# EAGLE schematic electronic-connection (EAGLE 7.7.0)
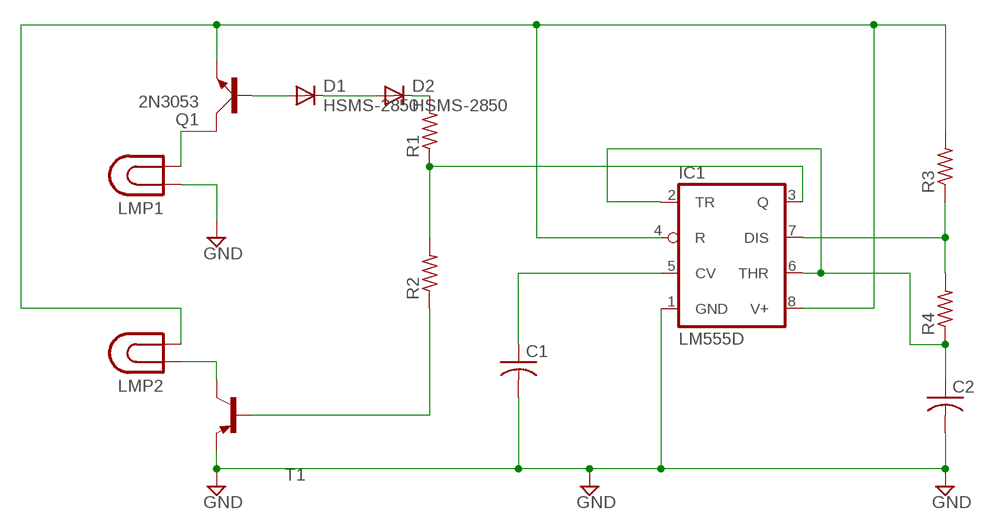
[diagram p0: schematic, sheet 1]

## Parts
C1  C-US025-024X044  [C025-024X044]
C2  C-US025-024X044  [C025-024X044]
D1  HSMS-2850  [SOT23]
D2  HSMS-2850  [SOT23]
IC1  LM555D  [SO08]
LMP1  LAMP  [LDH-5R]
LMP2  LAMP  [LDH-5R]
Q1  2N3053  [TO39]
R1  R-US_0204/2V  [0204V]
R2  R-US_0204/2V  [0204V]
R3  R-US_0204/2V  [0204V]
R4  R-US_0204/2V  [0204V]
T1  2N2905-PNP-TO39-EBC  [TO39]

## Nets
GND: C1.2 C2.2 IC1.1(GND) LMP1.1 T1.1(E)
N$1: IC1.4(R) IC1.8(V+) LMP2.2 Q1.1(E) R3.2
N$2: IC1.7(DIS) R3.1 R4.2
N$3: LMP1.2 Q1.3(C)
N$4: C1.1 IC1.5(CV)
N$5: C2.1 IC1.2(TR) IC1.6(THR) R4.1
N$6: IC1.3(Q) R1.1 R2.2
N$7: R2.1 T1.2(B)
N$8: LMP2.1 T1.3(C)
N$9: D1.1(A) Q1.2(B)
N$10: D1.3(C) D2.1(A)
N$11: D2.3(C) R1.2

## Library data of the parts
C1 C2 = rcl:C-US: CAPACITOR, American symbol
D1 D2 = avago:HSMS-2850: Surface Mount Microwave Schottky Detector Diodes Source: Data sheet <http://www.farnell.com/datasheets/461166.pdf>
IC1 = linear:*555: TIMER
LMP1 LMP2 = special:LAMP: LED HOLDER
Q1 = transistor-small-signal:2N3053: NPN TRANSISTOR
R1-R4 = rcl:R-US_: RESISTOR, American symbol
T1 = transistor-neu-to92:*-PNP-: PNP Transistror